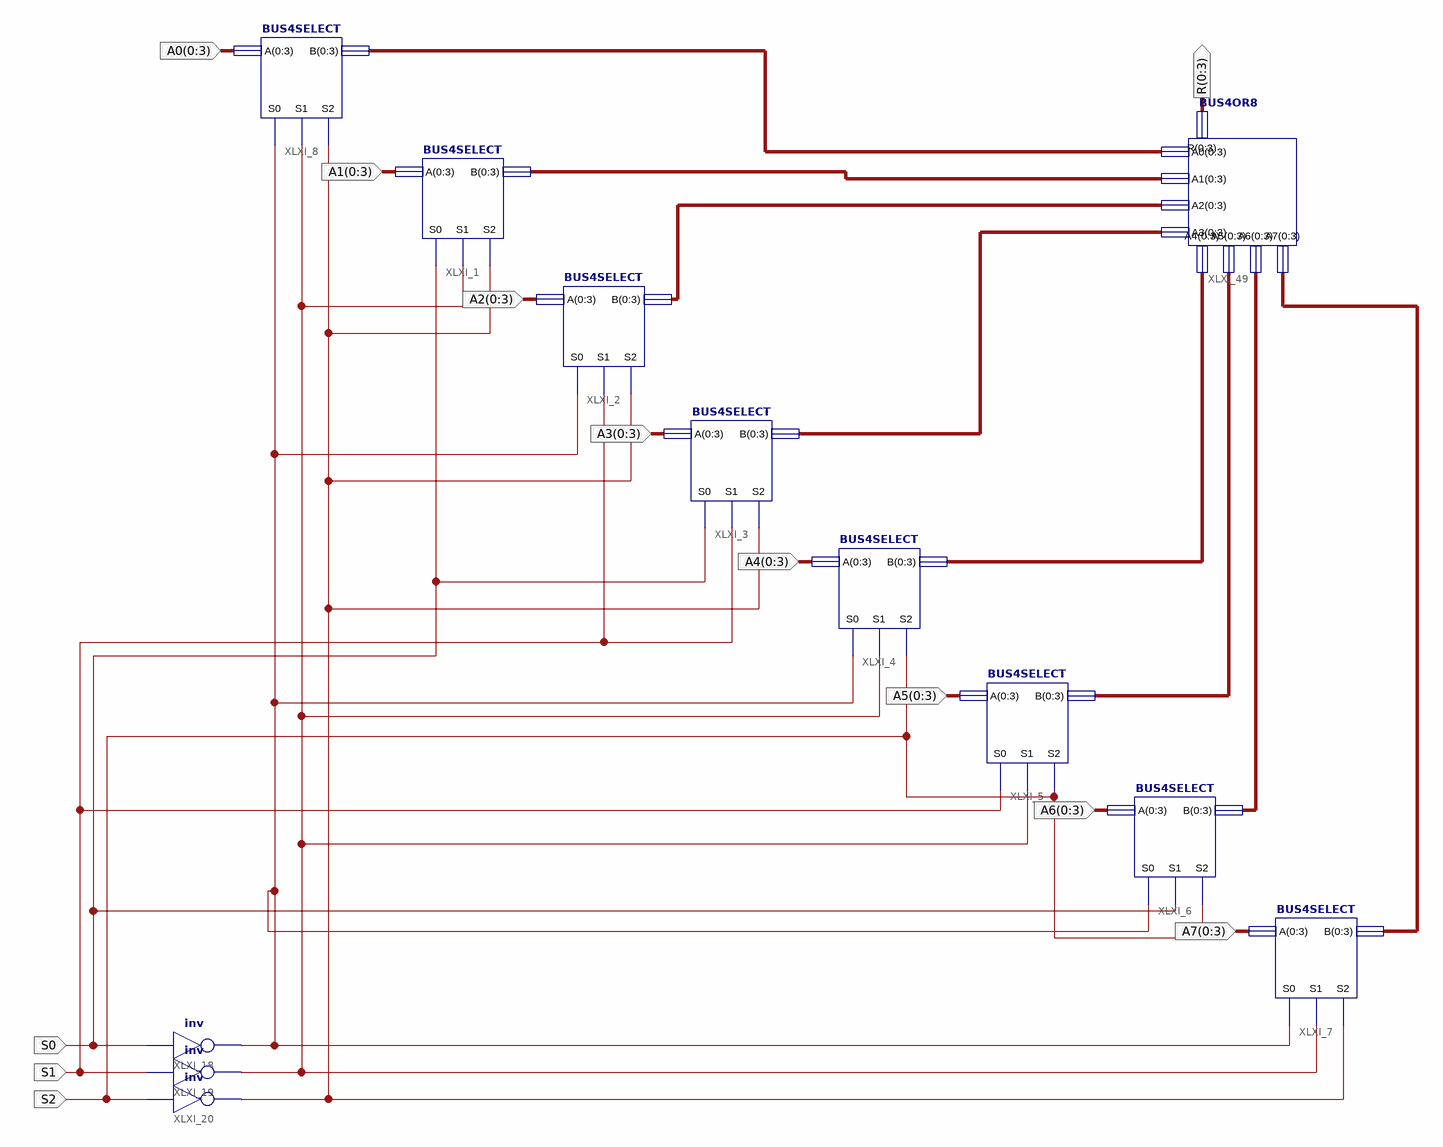
[diagram p0: schematic sheet 1]
// Xilinx ISE schematic MUX8W_4BIT.sch (spartan3e) as structural Verilog: 12 symbols, 12 ports
module MUX8W_4BIT (
  input  S0,
  input  S1,
  input  S2,
  input  [0:3] A0,
  input  [0:3] A1,
  input  [0:3] A2,
  input  [0:3] A3,
  input  [0:3] A4,
  input  [0:3] A5,
  input  [0:3] A6,
  input  [0:3] A7,
  output [0:3] R
);

  wire XLXN_28, XLXN_29, XLXN_31;
  wire [3:0] XLXN_44, XLXN_45, XLXN_46, XLXN_47, XLXN_48, XLXN_49, XLXN_50, XLXN_51;

  BUS4SELECT XLXI_3 (.A(A3), .B({XLXN_47[0], XLXN_47[1], XLXN_47[2], XLXN_47[3]}), .S0(S0), .S1(S1), .S2(XLXN_28));
  BUS4SELECT XLXI_4 (.A(A4), .B({XLXN_48[0], XLXN_48[1], XLXN_48[2], XLXN_48[3]}), .S0(XLXN_29), .S1(XLXN_31), .S2(S2));
  BUS4SELECT XLXI_5 (.A(A5), .B({XLXN_49[0], XLXN_49[1], XLXN_49[2], XLXN_49[3]}), .S0(S1), .S1(XLXN_31), .S2(S2));
  BUS4SELECT XLXI_6 (.A(A6), .B({XLXN_50[0], XLXN_50[1], XLXN_50[2], XLXN_50[3]}), .S0(XLXN_29), .S1(S0), .S2(S2));
  BUS4SELECT XLXI_7 (
    .A(A7), .B({XLXN_51[0], XLXN_51[1], XLXN_51[2], XLXN_51[3]}), .S0(XLXN_29), .S1(XLXN_31), .S2(XLXN_28));
  BUS4SELECT XLXI_1 (.A(A1), .B({XLXN_45[0], XLXN_45[1], XLXN_45[2], XLXN_45[3]}), .S0(S0), .S1(XLXN_31), .S2(XLXN_28));
  BUS4SELECT XLXI_2 (.A(A2), .B({XLXN_46[0], XLXN_46[1], XLXN_46[2], XLXN_46[3]}), .S0(XLXN_29), .S1(S1), .S2(XLXN_28));
  BUS4SELECT XLXI_8 (
    .A(A0), .B({XLXN_44[0], XLXN_44[1], XLXN_44[2], XLXN_44[3]}), .S0(XLXN_29), .S1(XLXN_31), .S2(XLXN_28));
  not XLXI_20 (XLXN_28, S2);
  not XLXI_18 (XLXN_29, S0);
  not XLXI_19 (XLXN_31, S1);
  BUS4OR8 XLXI_49 (
    .A0({XLXN_44[0], XLXN_44[1], XLXN_44[2], XLXN_44[3]}),
    .A1({XLXN_45[0], XLXN_45[1], XLXN_45[2], XLXN_45[3]}),
    .A2({XLXN_46[0], XLXN_46[1], XLXN_46[2], XLXN_46[3]}),
    .A3({XLXN_47[0], XLXN_47[1], XLXN_47[2], XLXN_47[3]}),
    .A4({XLXN_48[0], XLXN_48[1], XLXN_48[2], XLXN_48[3]}),
    .A5({XLXN_49[0], XLXN_49[1], XLXN_49[2], XLXN_49[3]}),
    .A6({XLXN_50[0], XLXN_50[1], XLXN_50[2], XLXN_50[3]}),
    .A7({XLXN_51[0], XLXN_51[1], XLXN_51[2], XLXN_51[3]}), .R(R));
endmodule
